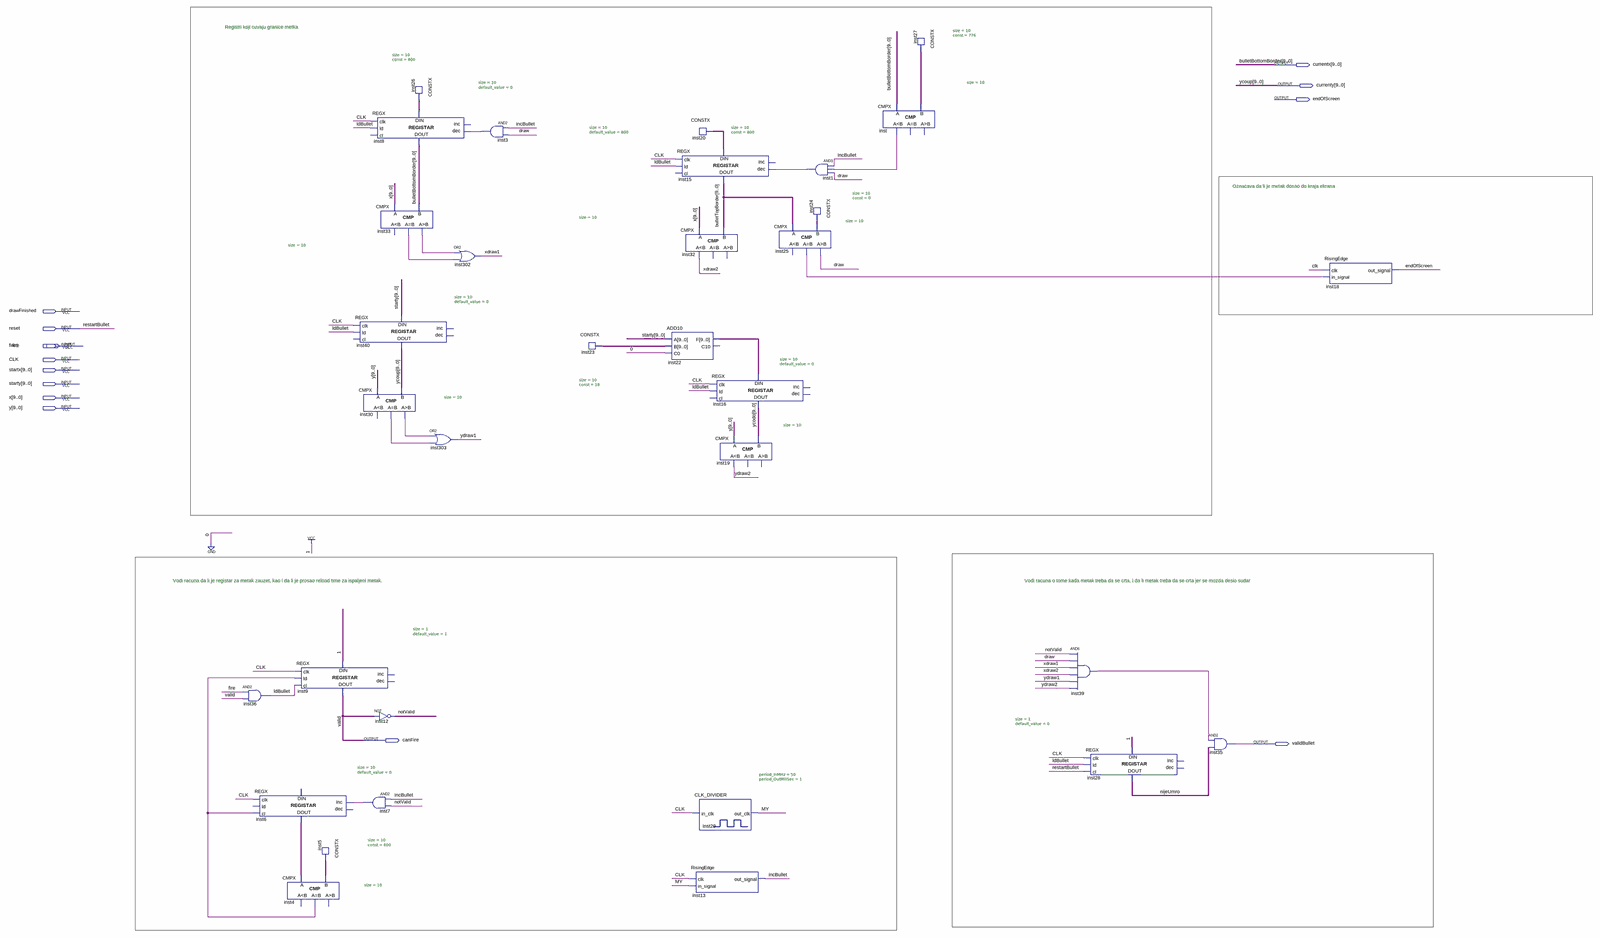
[diagram p0: schematic sheet, whole]
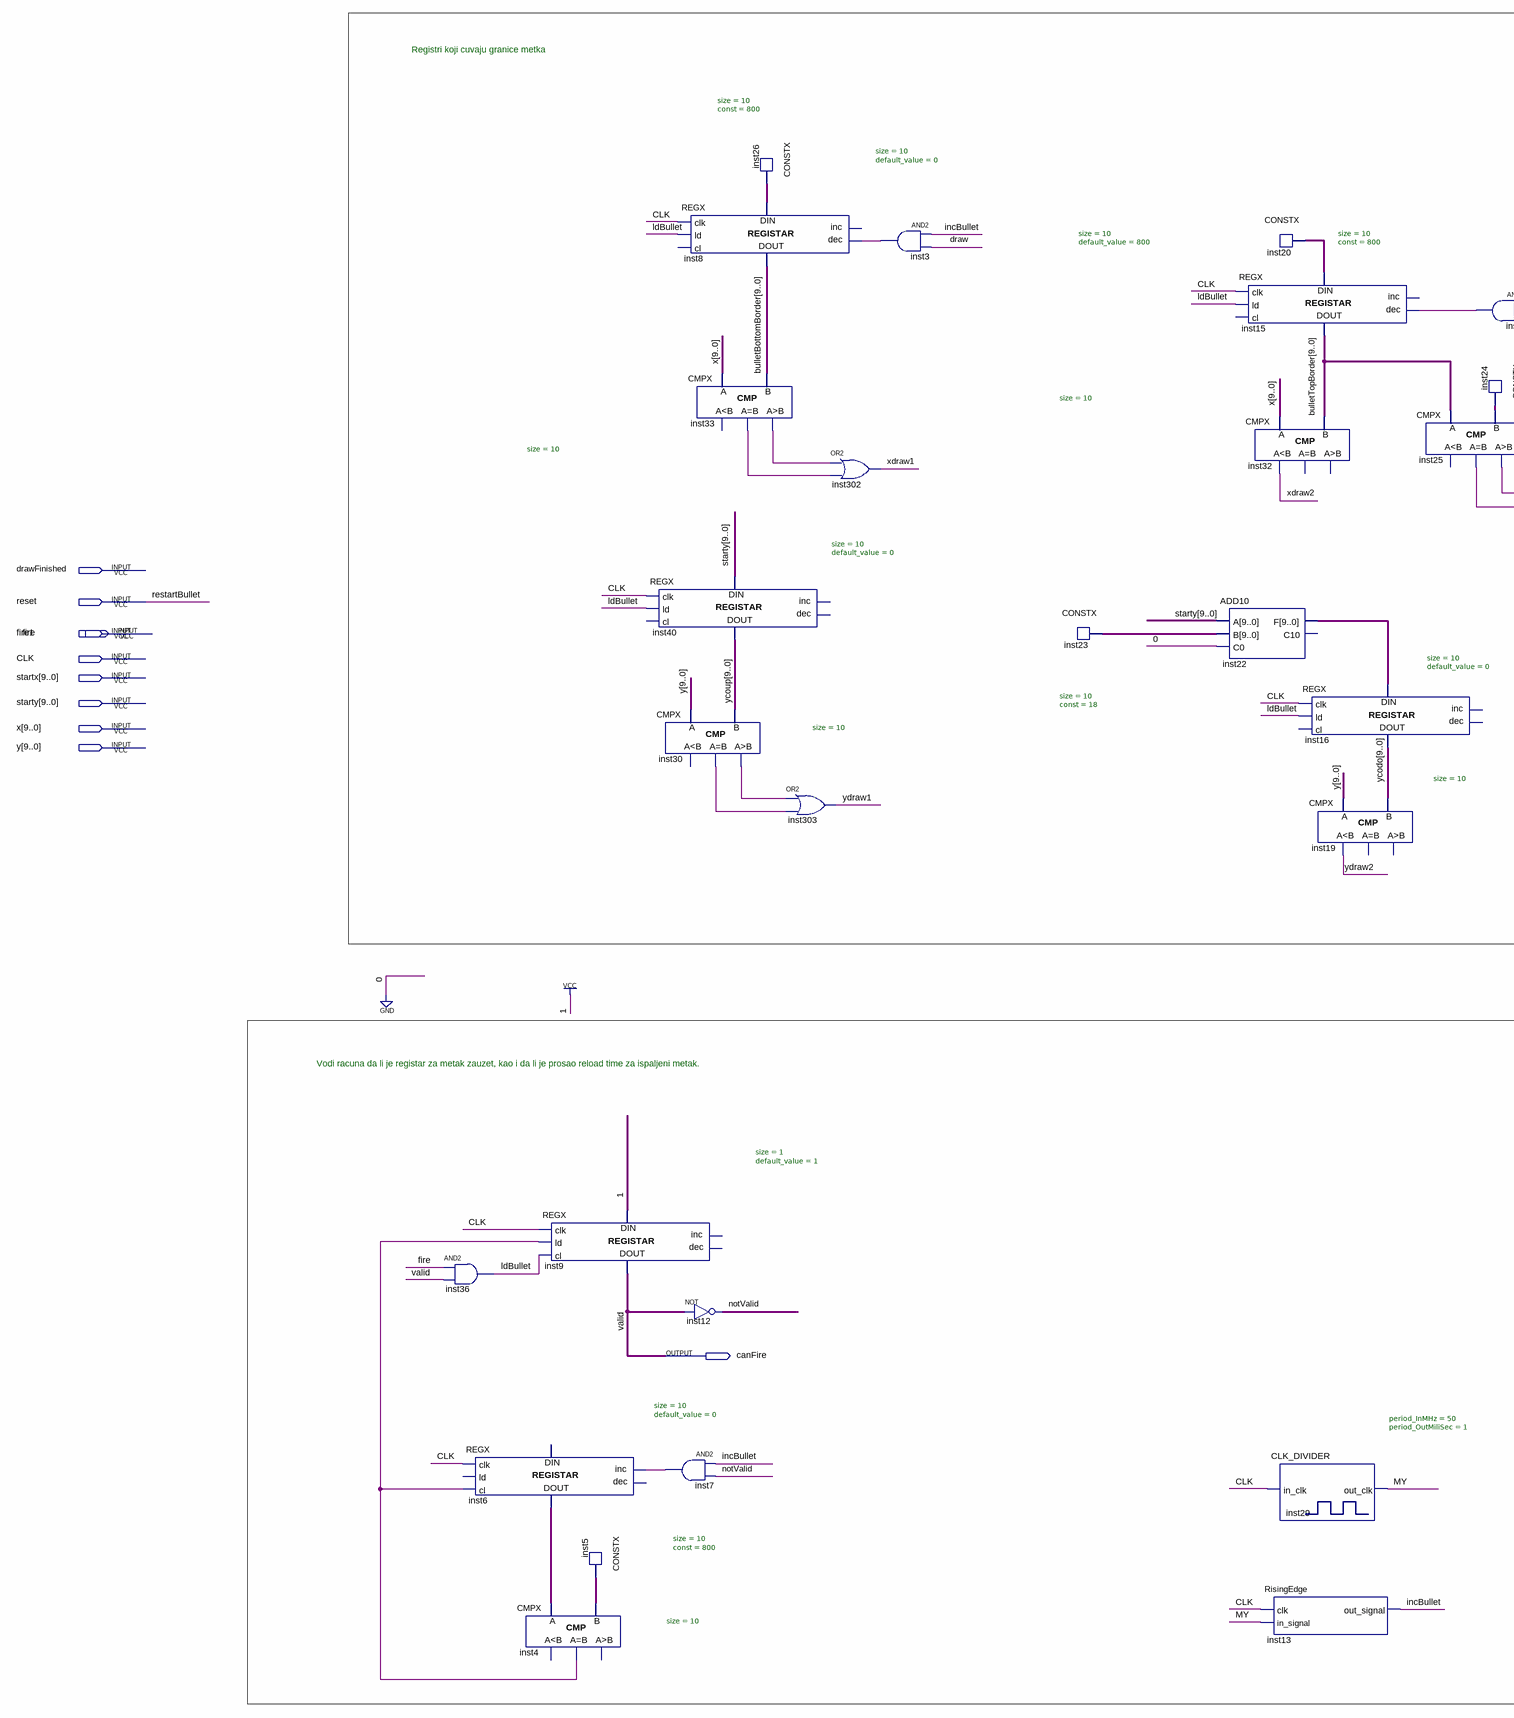
[diagram p1: schematic sheet, left part]
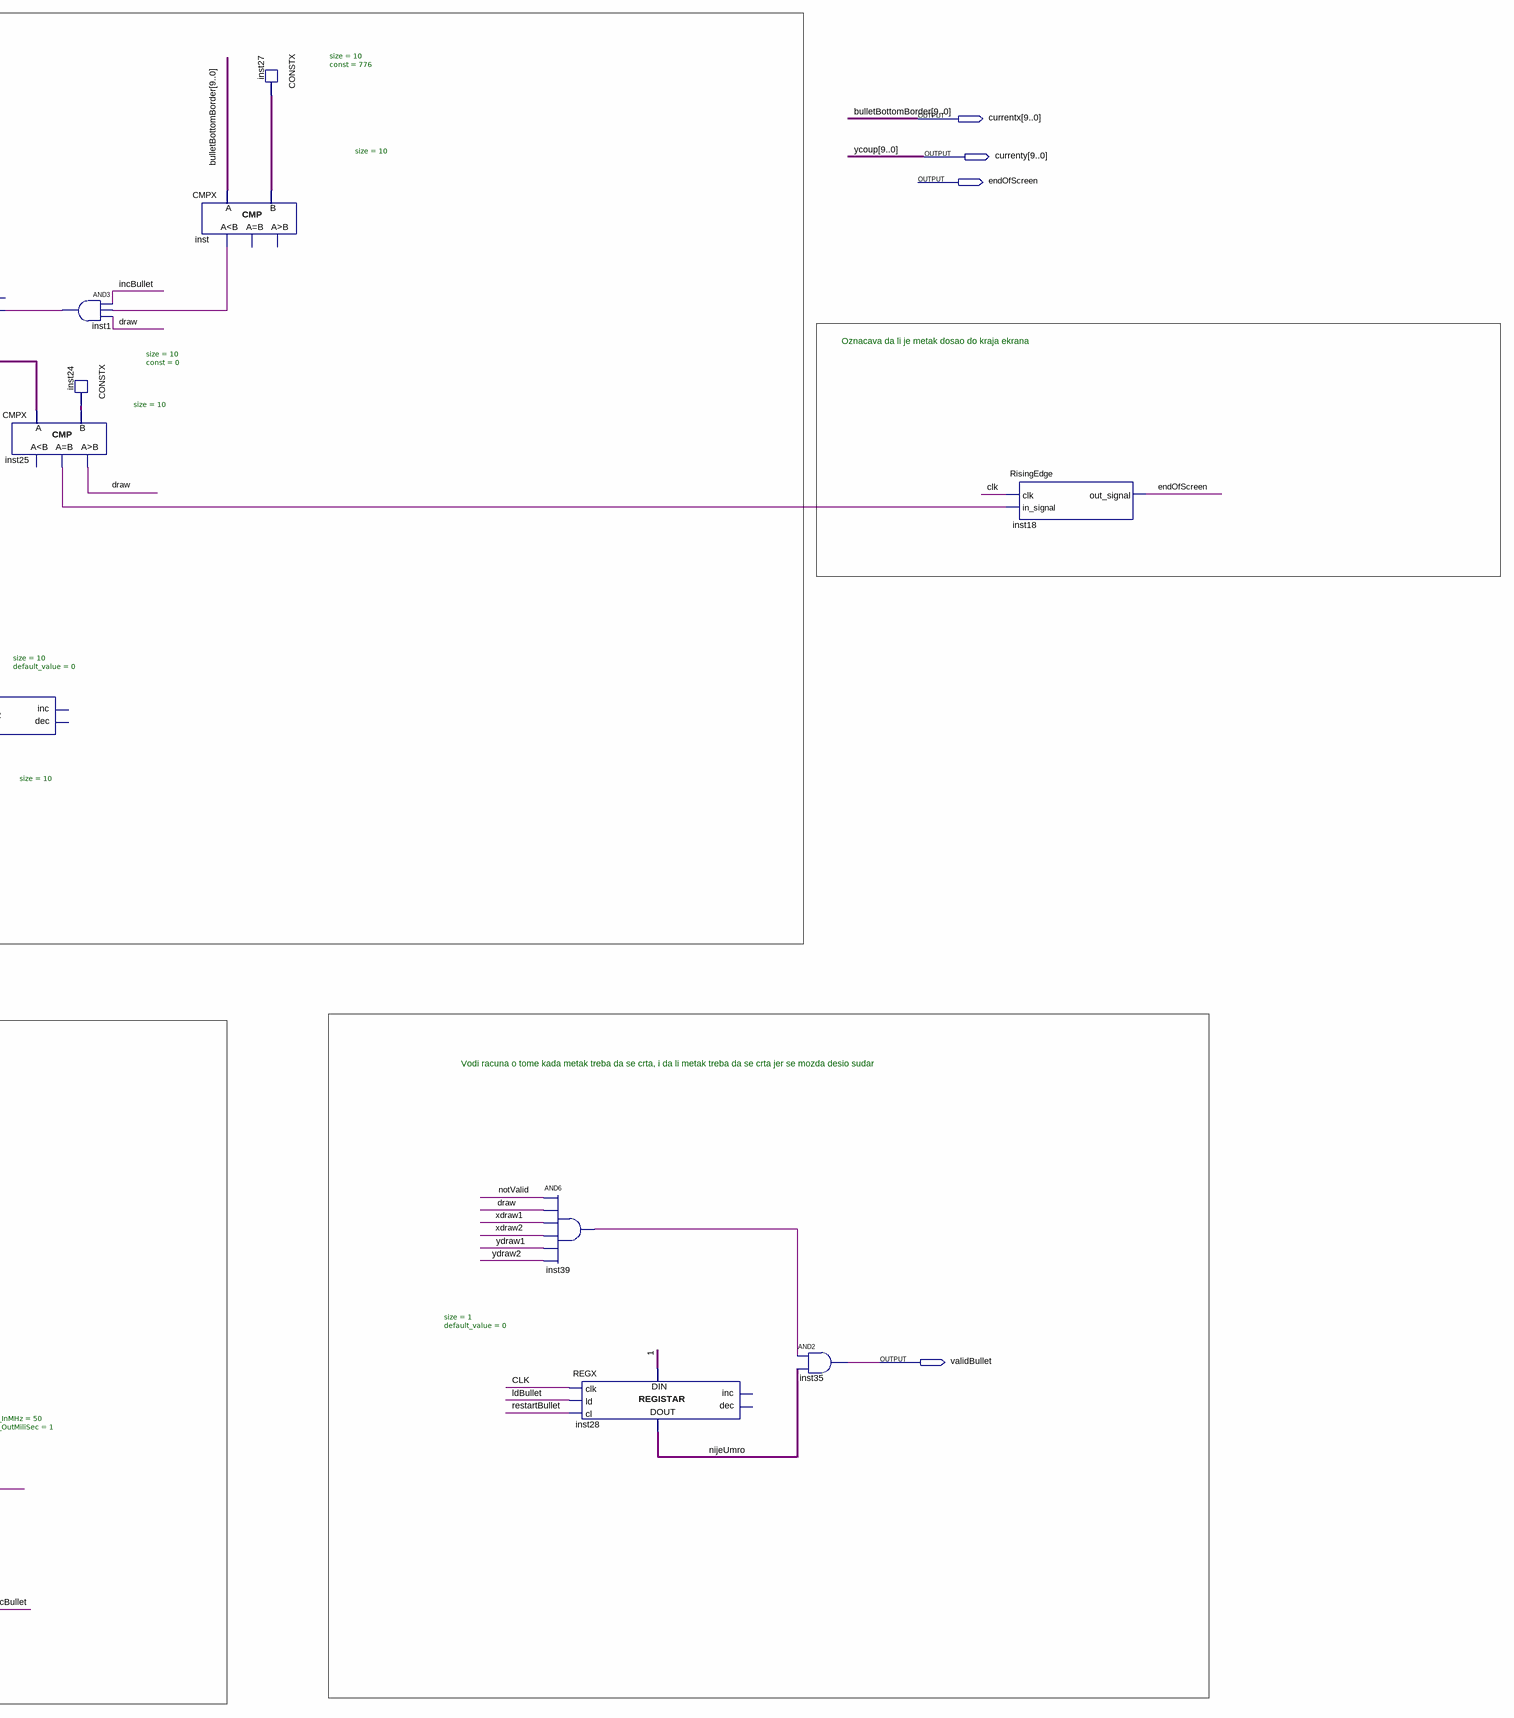
[diagram p2: schematic sheet, right part]
// Quartus schematic BulletBadBoy.bdf as structural Verilog: 33 symbols, 14 pins
module BulletBadBoy (
  input  drawFinished,
  input  reset,
  input  fire1,
  input  fire,
  input  CLK,
  input  [9:0] startx,
  input  [9:0] starty,
  input  [9:0] x,
  input  [9:0] y,
  output [9:0] currentx,
  output [9:0] currenty,
  output endOfScreen,
  output canFire,
  output validBullet
);

  wire draw, incBullet, inst1_out, inst3_out, inst4_eq, inst7_out, inst25_eq, inst30_eq, inst30_gr,
       inst33_eq, inst33_gr, inst39_out, inst_ls, ldBullet, MY, nijeUmro, notValid, xdraw1, xdraw2, ydraw1,
       ydraw2;
  wire [9:0] bulletTopBorder, inst5_data, inst6_data_out, inst20_data, inst22_f, inst23_data, inst24_data,
       inst26_data, inst27_data, ycodo;

  and inst36 (ldBullet, fire, canFire);
  REGX #(.size(10), .default_value(0)) inst6 (
    .clk(CLK), .cl(inst4_eq), .inc(inst7_out), .data_out(inst6_data_out));  // open: ld, dec, data_in
  REGX #(.size(1), .default_value(1)) inst9 (
    .clk(CLK), .ld(inst4_eq), .cl(ldBullet), .data_in(1'b1), .data_out(canFire));  // open: inc, dec
  CMPX #(.size(10)) inst4 (.A(inst6_data_out), .B(inst5_data), .eq(inst4_eq));  // open: ls, gr
  CONSTX #(.size(10), .\const (800)) inst5 (.data(inst5_data));
  REGX #(.size(10), .default_value(0)) inst40 (
    .clk(CLK), .ld(ldBullet), .data_in(starty), .data_out(currenty));  // open: cl, inc, dec
  REGX #(.size(10), .default_value(0)) inst8 (
    .clk(CLK), .ld(ldBullet), .dec(inst3_out), .data_in(inst26_data), .data_out(currentx));  // open: cl, inc
  CMPX #(.size(10)) inst33 (.A(x), .B(currentx), .eq(inst33_eq), .gr(inst33_gr));  // open: ls
  CMPX #(.size(10)) inst30 (.A(y), .B(currenty), .eq(inst30_eq), .gr(inst30_gr));  // open: ls
  not inst12 (notValid, canFire);
  and inst7 (inst7_out, incBullet, notValid);
  CONSTX #(.size(10), .\const (800)) inst26 (.data(inst26_data));
  or inst303 (ydraw1, inst30_gr, inst30_eq);
  or inst302 (xdraw1, inst33_gr, inst33_eq);
  and inst3 (inst3_out, incBullet, draw);
  CONSTX #(.size(10), .\const (18)) inst23 (.data(inst23_data));
  REGX #(.size(10), .default_value(800)) inst15 (
    .clk(CLK), .ld(ldBullet), .dec(inst1_out), .data_in(inst20_data), .data_out(bulletTopBorder));  // open: cl, inc
  CMPX #(.size(10)) inst32 (.A(x), .B(bulletTopBorder), .ls(xdraw2));  // open: eq, gr
  ADD10 inst22 (.A(starty), .B(inst23_data), .C0(1'b0), .F(inst22_f));  // open: C10
  CONSTX #(.size(10), .\const (800)) inst20 (.data(inst20_data));
  REGX #(.size(10), .default_value(0)) inst16 (
    .clk(CLK), .ld(ldBullet), .data_in(inst22_f), .data_out(ycodo));  // open: cl, inc, dec
  CMPX #(.size(10)) inst19 (.A(y), .B(ycodo), .ls(ydraw2));  // open: eq, gr
  CLK_DIVIDER #(.period_InMHz(50), .period_OutMiliSec(1)) inst29 (.in_clk(CLK), .out_clk(MY));
  RisingEdge inst13 (.clk(CLK), .in_signal(MY), .out_signal(incBullet));
  CMPX #(.size(10)) inst25 (.A(bulletTopBorder), .B(inst24_data), .eq(inst25_eq), .gr(draw));  // open: ls
  and inst1 (inst1_out, incBullet, inst_ls, draw);
  CONSTX #(.size(10), .\const (0)) inst24 (.data(inst24_data));
  CMPX #(.size(10)) inst (.A(currentx), .B(inst27_data), .ls(inst_ls));  // open: eq, gr
  CONSTX #(.size(10), .\const (776)) inst27 (.data(inst27_data));
  and inst39 (inst39_out, notValid, draw, xdraw1, xdraw2, ydraw1, ydraw2);
  REGX #(.size(1), .default_value(0)) inst28 (
    .clk(CLK), .ld(ldBullet), .cl(reset), .data_in(1'b1), .data_out(nijeUmro));  // open: inc, dec
  and inst35 (validBullet, inst39_out, nijeUmro);
  RisingEdge inst18 (.clk(CLK), .in_signal(inst25_eq), .out_signal(endOfScreen));

  // Other names for the same wires on the sheet: bulletBottomBorder[9:0] = currentx; restartBullet = reset;
  //   valid = canFire; ycoup[9:0] = currenty

  // Notes on the sheet:
  //   Registri koji cuvaju granice metka  
  //   Oznacava da li je metak dosao do kraja ekrana          
  //   Vodi racuna da li je registar za metak zauzet, kao i da li je prosao reload time za ispaljeni metak.
  //   Vodi racuna o tome kada metak treba da se crta, i da li metak treba da se crta jer se mozda desio sudar                      
endmodule
